# Altium schematic sheet CW308T_SAM4L_Micro.SchDoc: Main Microcontroller
size Letter; Organization: NewAE Technology Inc.; Address1: 1083 Queen St., Suite 196; Address2: Halifax; Address3: NS; Address4: Canada B3H 0B2; SheetNumber: 1; SheetTotal: 2; SheetApproved: YES
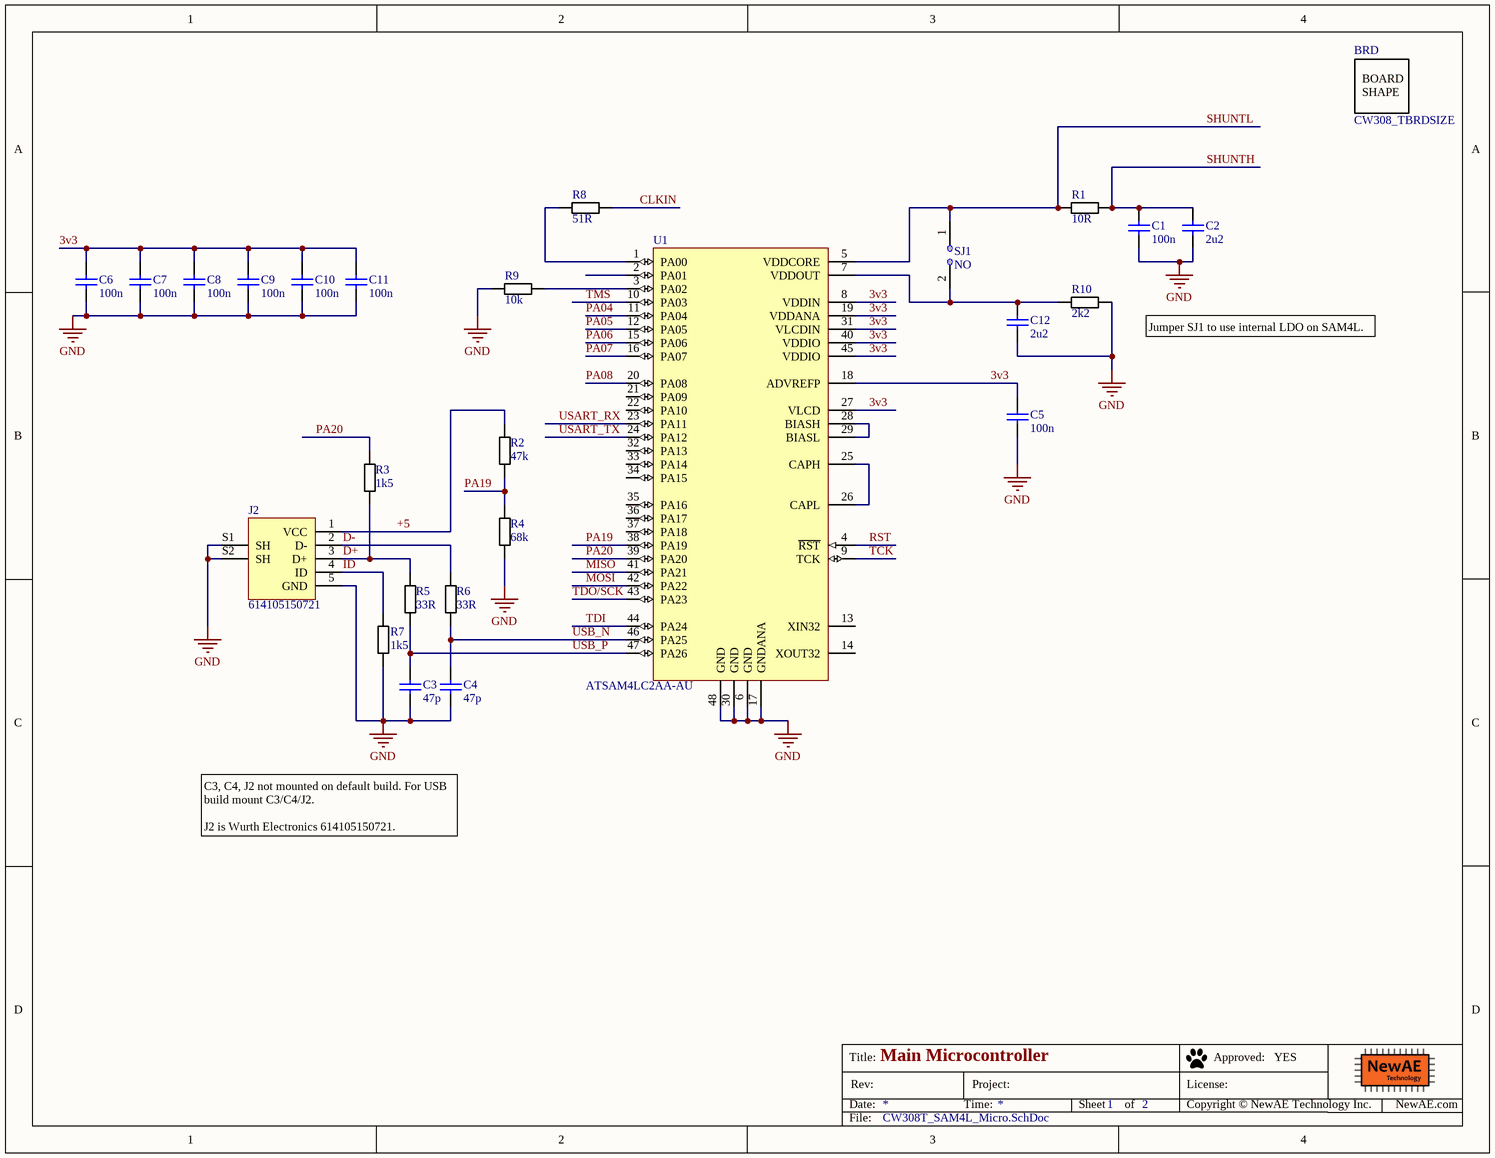
[diagram p0: CW308T_SAM4L_Micro.SchDoc]

## Parts
BRD  CW308_TBRDSIZE  [CW308T_TBOARD_DEFSIZE]
C1  100n  [CAPC0603_M]
C2  2u2  [CAPC0603_M]
C3  47p  [CAPC0603_M]
C4  47p  [CAPC0603_M]
C5  100n  [CAPC0603_M]
C6  100n  [CAPC0603_M]
C7  100n  [CAPC0603_M]
C8  100n  [CAPC0603_M]
C9  100n  [CAPC0603_M]
C10  100n  [CAPC0603_M]
C11  100n  [CAPC0603_M]
C12  2u2  [CAPC0603_M]
J2  614105150721  [614105150721]
R1  10R  [RESC1608X55N]
R2  47k  [RESC1608X55N]
R3  1k5  [RESC1608X55N]
R4  68k  [RESC1608X55N]
R5  33R  [RESC1608X55N]
R6  33R  [RESC1608X55N]
R7  1k5  [RESC1608X55N]
R8  51R  [RESC1608X55N]
R9  10k  [RESC1608X55N]
R10  2k2  [RESC1608X55N]
SJ1  NO  [SJ_2S_NO]  (no BOM)
U1  ATSAM4LC2AA-AU  [TSQFP50P900X900X120-48N]

## Nets
GND: C1.2 C2.2 C3.2 C4.2 C5.2 C6.2 C7.2 C8.2 C9.2 C10.2 C11.2 C12.2 J2.5(GND) J2.S1(SH) J2.S2(SH) R4.2 R7.2 R9.1 R10.2 U1.6(GND) U1.17(GNDANA) U1.30(GND) U1.48(GND)
3v3: C5.1 C6.1 C7.1 C8.1 C9.1 C10.1 C11.1 U1.8(VDDIN) U1.18(ADVREFP) U1.19(VDDANA) U1.27(VLCD) U1.31(VLCDIN) U1.40(VDDIO) U1.45(VDDIO)
+5: J2.1(VCC) R2.1
CLKIN: R8.2
D+: J2.3(D+) R3.1 R5.2
D-: J2.2(D-) R6.1
ID: J2.4(ID) R7.1
MISO: U1.41(PA21)
MOSI: U1.42(PA22)
PA04: U1.11(PA04)
PA05: U1.12(PA05)
PA06: U1.15(PA06)
PA07: U1.16(PA07)
PA08: U1.20(PA08)
PA19: R2.2 R4.1 U1.38(PA19)
PA20: R3.2 U1.39(PA20)
RST: U1.4(~{RST})
SHUNTH: C1.1 C2.1 R1.2
SHUNTL: R1.1 SJ1.1 U1.5(VDDCORE)
TCK: U1.9(TCK)
TDI: U1.44(PA24)
TDO/SCK: U1.43(PA23)
TMS: U1.10(PA03)
USART_RX: U1.23(PA11)
USART_TX: U1.24(PA12)
USB_N: C4.1 R6.2 U1.46(PA25)
USB_P: C3.1 R5.1 U1.47(PA26)
NetC12_1: C12.1 R10.1 SJ1.2 U1.7(VDDOUT)
NetR8_1: R8.1 U1.1(PA00)
NetR9_2: R9.2 U1.3(PA02)
NetU1_25: U1.25(CAPH) U1.26(CAPL)
NetU1_28: U1.28(BIASH) U1.29(BIASL)

Not connected (* = marked no-connect by the designer): U1 2(PA01) 13(XIN32) 14(XOUT32) 21(PA09) 22(PA10) 32(PA13) 33(PA14) 34(PA15) 35(PA16) 36(PA17) 37(PA18)

## Notes on the sheet
- (near R10) Jumper SJ1 to use internal LDO on SAM4L.
- C3, C4, J2 not mounted on default build. For USB build mount C3/C4/J2.
  J2 is Wurth Electronics 614105150721.
- Title:
- Date:
- Rev:
- Time:
- Project:
- Sheet
- of
- License:
- Copyright © NewAE Technology Inc.
- Approved:
- NewAE.com
- File:
- (in symbol CW308T_BRDSHAPE_DEFAULT) BOARD / SHAPE

## Library data of the parts
BRD = CW308T_BRDSHAPE_DEFAULT: 308T Board Outline (Layer 1); Component Group: Mechanical; Part Number: CW308T_BRDSHAPE_DEFAULT; Component Kind: Mechanical; Component Type: Mechanical
C1 C5-C11 = CCHIP-100n-0603: 100n, 0603; Manufacture 1: Kemet; Manufacture Part Number 1: C0603C104K5RACTU; Component Group: Capacitor; Case-EIA: 0603; Case-Metric: 1608; Rated Voltage: 50V; Part Number: CCHIP-100n-0603; Footprint: 0603; Pin Count: 2; Supplier 1: Digi-Key; Supplier Part Number 1: 399-5089-2-ND; Value: 100n; Mounting Technology: SMT; Component Kind: Standard; Component Type: Standard
C2 C12 = CCHIP-2u2-0603: 2u2, 0603; Manufacture 1: Samsung; Manufacture Part Number 1: CL10B225KP8NNNC; Component Group: Capacitor; Case-EIA: 0603; Case-Metric: 1608; Part Number: CCHIP-2u2-0603; Footprint: 0603; Pin Count: 2; Supplier 1: Digi-Key; Supplier Part Number 1: 1276-1134-2-ND; Value: 2u2; Mounting Technology: SMT; Component Kind: Standard; Component Type: Standard
C3 C4 = CCHIP-47p-0603: 47p, 0603; Component Group: Capacitor; Case-EIA: 0603; Case-Metric: 1608; Part Number: CCHIP-47p-0603; Footprint: 0603; Pin Count: 2; Value: 47p; Mounting Technology: SMT; Component Kind: Standard; Component Type: Standard
J2 = 614105150721: USB, 5-pin, Upright; Manufacture 1: Wurth Electronics; Component Group: Connector; PP Material Stack: 0; Part Number: 614105150721; Manufacture Part Number 1: 614105150721; Pin Count: 7; Supplier 1: Digi-Key; Supplier Part Number 1: 732-5958-1-ND; Mounting Technology: Through-hole; RoHS: Yes; Component Kind: Standard; Component Type: Standard; PP Rotation: 0
R1 = RCHIP-10R-0603: 10R res, 0603, 1%, 1/10W; Manufacture 1: Yageo; Manufacture Part Number 1: RC0603FR-0710RL; Component Group: Resistor; Case-EIA: 0603; Case-Metric: 1608; Rated Power: 0.1W; Rated Voltage: 75VDC; Part Number: RCHIP-10R-0603; Footprint: 0603; Pin Count: 2; Supplier 1: Digi-Key; Supplier Part Number 1: 311-10.0HRCT-ND; Value: 10R; Tolerance: 1%; Mounting Technology: SMT; Temperature Range: -55C to 155C; Component Kind: Standard; Component Type: Standard
R2 = RCHIP-47K-0603: 47k res, 0603, 1%, 1/10W; Manufacture 1: Yageo; Manufacture Part Number 1: RC0603FR-0747KL; Component Group: Resistor; Case-EIA: 0603; Case-Metric: 1608; Rated Power: 0.1W; Rated Voltage: 75VDC; Part Number: RCHIP-47K-0603; Footprint: 0603; Pin Count: 2; Supplier 1: Digi-Key; Supplier Part Number 1: 311-47.0KHRCT-ND; Value: 47k; Tolerance: 1%; Mounting Technology: SMT; Temperature Range: -55C to 155C; Component Kind: Standard; Component Type: Standard
R3 R7 = RCHIP-1K5-0603: 1k5 res, 0603, 1%, 1/10W; Manufacture 1: Yageo; Manufacture Part Number 1: RC0603FR-071K5L; Component Group: Resistor; Case-EIA: 0603; Case-Metric: 1608; Rated Power: 0.1W; Rated Voltage: 75VDC; Part Number: RCHIP-1K5-0603; Footprint: 0603; Pin Count: 2; Supplier 1: Digi-Key; Supplier Part Number 1: 311-1.50KHRCT-ND; Value: 1k5; Tolerance: 1%; Mounting Technology: SMT; Temperature Range: -55C to 155C; Component Kind: Standard; Component Type: Standard
R4 = RCHIP-68K-0603: 68k res, 0603, 1%, 1/10W; Manufacture 1: Yageo; Manufacture Part Number 1: RC0603FR-0768KL; Component Group: Resistor; Case-EIA: 0603; Case-Metric: 1608; Rated Power: 0.1W; Rated Voltage: 75VDC; Part Number: RCHIP-68K-0603; Footprint: 0603; Pin Count: 2; Supplier 1: Digi-Key; Supplier Part Number 1: 311-68.0KHRCT-ND; Value: 68k; Tolerance: 1%; Mounting Technology: SMT; Temperature Range: -55C to 155C; Component Kind: Standard; Component Type: Standard
R5 R6 = RCHIP-33R-0603: 33R res, 0603, 1%, 1/10W; Manufacture 1: Yageo; Manufacture Part Number 1: RC0603FR-0733RL; Component Group: Resistor; Case-EIA: 0603; Case-Metric: 1608; Rated Power: 0.1W; Rated Voltage: 75VDC; Part Number: RCHIP-33R-0603; Footprint: 0603; Pin Count: 2; Supplier 1: Digi-Key; Supplier Part Number 1: 311-33.0HRCT-ND; Value: 33R; Tolerance: 1%; Mounting Technology: SMT; Temperature Range: -55C to 155C; Component Kind: Standard; Component Type: Standard
R8 = RCHIP-51R-0603: 51R res, 0603, 1%, 1/10W; Manufacture 1: Yageo; Manufacture Part Number 1: RC0603FR-0751RL; Component Group: Resistor; Case-EIA: 0603; Case-Metric: 1608; Rated Power: 0.1W; Rated Voltage: 75VDC; Part Number: RCHIP-51R-0603; Footprint: 0603; Pin Count: 2; Supplier 1: Digi-Key; Supplier Part Number 1: 311-51.0HRCT-ND; Value: 51R; Tolerance: 1%; Mounting Technology: SMT; Temperature Range: -55C to 155C; Component Kind: Standard; Component Type: Standard
R9 = RCHIP-10K-0603: 10k res, 0603, 1%, 1/10W; Manufacture 1: Yageo; Manufacture Part Number 1: RC0603FR-0710KL; Component Group: Resistor; Case-EIA: 0603; Case-Metric: 1608; Rated Power: 0.1W; Rated Voltage: 75VDC; Part Number: RCHIP-10K-0603; Footprint: 0603; Pin Count: 2; Supplier 1: Digi-Key; Supplier Part Number 1: 311-10.0KHRCT-ND; Value: 10k; Tolerance: 1%; Mounting Technology: SMT; Temperature Range: -55C to 155C; Component Kind: Standard; Component Type: Standard
R10 = RCHIP-2K2-0603: 2k2 res, 0603, 1%, 1/10W; Manufacture 1: Yageo; Manufacture Part Number 1: RC0603FR-072K2L; Component Group: Resistor; Case-EIA: 0603; Case-Metric: 1608; Rated Power: 0.1W; Rated Voltage: 75VDC; Part Number: RCHIP-2K2-0603; Footprint: 0603; Pin Count: 2; Supplier 1: Digi-Key; Supplier Part Number 1: 311-2.20KHRCT-ND; Value: 2k2; Tolerance: 1%; Mounting Technology: SMT; Temperature Range: -55C to 155C; Component Kind: Standard; Component Type: Standard
SJ1 = SJ_2S_NO: Solder Jumper, NO; Component Group: PCB Feature; Part Number: SJ_2S_NO; Pin Count: 2; Mounting Technology: COPPER; Component Type: Standard (No BOM)
U1 = ATSAM4LC2AA-AU: Atmel, SAM4L, 48-TQFP; Component Group: Digital IC; Pitch: 0.5mm; Part Number: ATSAM4LC2AA-AU; Footprint: TQFP48, 0.5mm; Manufacture 1: Atmel; Manufacture Part Number 1: ATSAM4LC2AA-AU; Pin Count: 48; Supplier 1: Digi-Key; Supplier Part Number 1: ATSAM4LC2AA-AU-ND; Mounting Technology: SMT; RoHS: Yes; Component Kind: Standard; Component Type: Standard